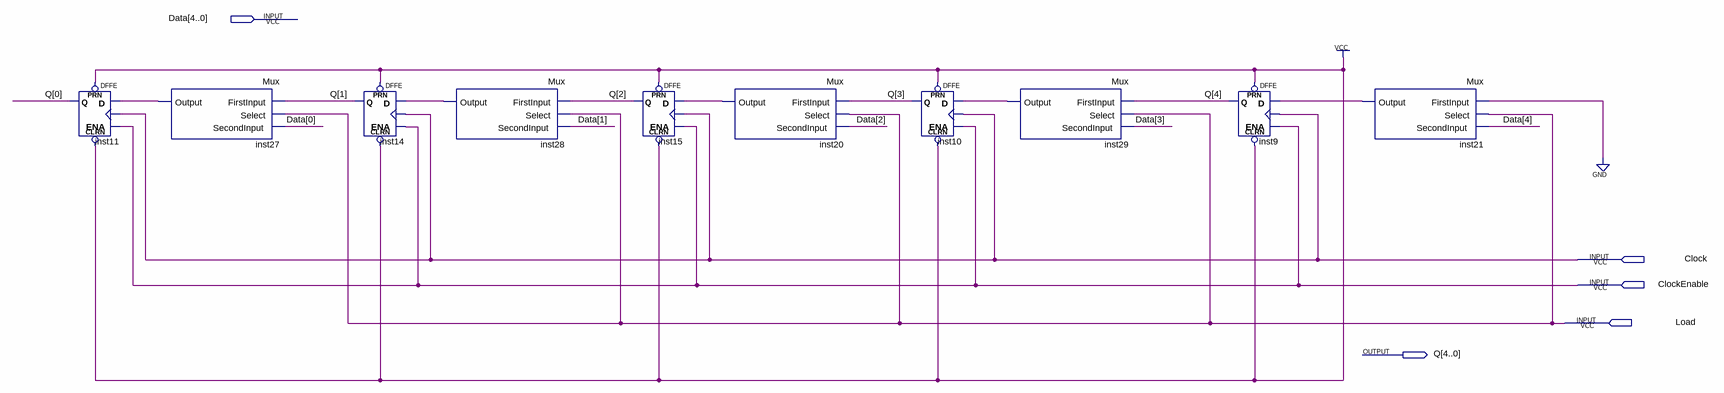
[diagram p0: schematic sheet]
// Quartus schematic Register.bdf as structural Verilog: 10 symbols, 5 pins
module Register (
  input  [4:0] Data,
  input  Clock,
  input  ClockEnable,
  input  Load,
  output [4:0] Q
);

  wire inst20_output, inst21_output, inst27_output, inst28_output, inst29_output;

  DFFE inst11 (.PRN(1'b1), .CLRN(1'b1), .D(inst27_output), .CLK(Clock), .ENA(ClockEnable), .Q(Q[0]));
  Mux inst27 (.FirstInput(Q[1]), .Select(Load), .SecondInput(Data[0]), .Output(inst27_output));
  DFFE inst14 (.PRN(1'b1), .CLRN(1'b1), .D(inst28_output), .CLK(Clock), .ENA(ClockEnable), .Q(Q[1]));
  Mux inst28 (.FirstInput(Q[2]), .Select(Load), .SecondInput(Data[1]), .Output(inst28_output));
  DFFE inst15 (.PRN(1'b1), .CLRN(1'b1), .D(inst20_output), .CLK(Clock), .ENA(ClockEnable), .Q(Q[2]));
  Mux inst20 (.FirstInput(Q[3]), .Select(Load), .SecondInput(Data[2]), .Output(inst20_output));
  DFFE inst10 (.PRN(1'b1), .CLRN(1'b1), .D(inst29_output), .CLK(Clock), .ENA(ClockEnable), .Q(Q[3]));
  Mux inst29 (.FirstInput(Q[4]), .Select(Load), .SecondInput(Data[3]), .Output(inst29_output));
  DFFE inst9 (.PRN(1'b1), .CLRN(1'b1), .D(inst21_output), .CLK(Clock), .ENA(ClockEnable), .Q(Q[4]));
  Mux inst21 (.FirstInput(1'b0), .Select(Load), .SecondInput(Data[4]), .Output(inst21_output));
endmodule
